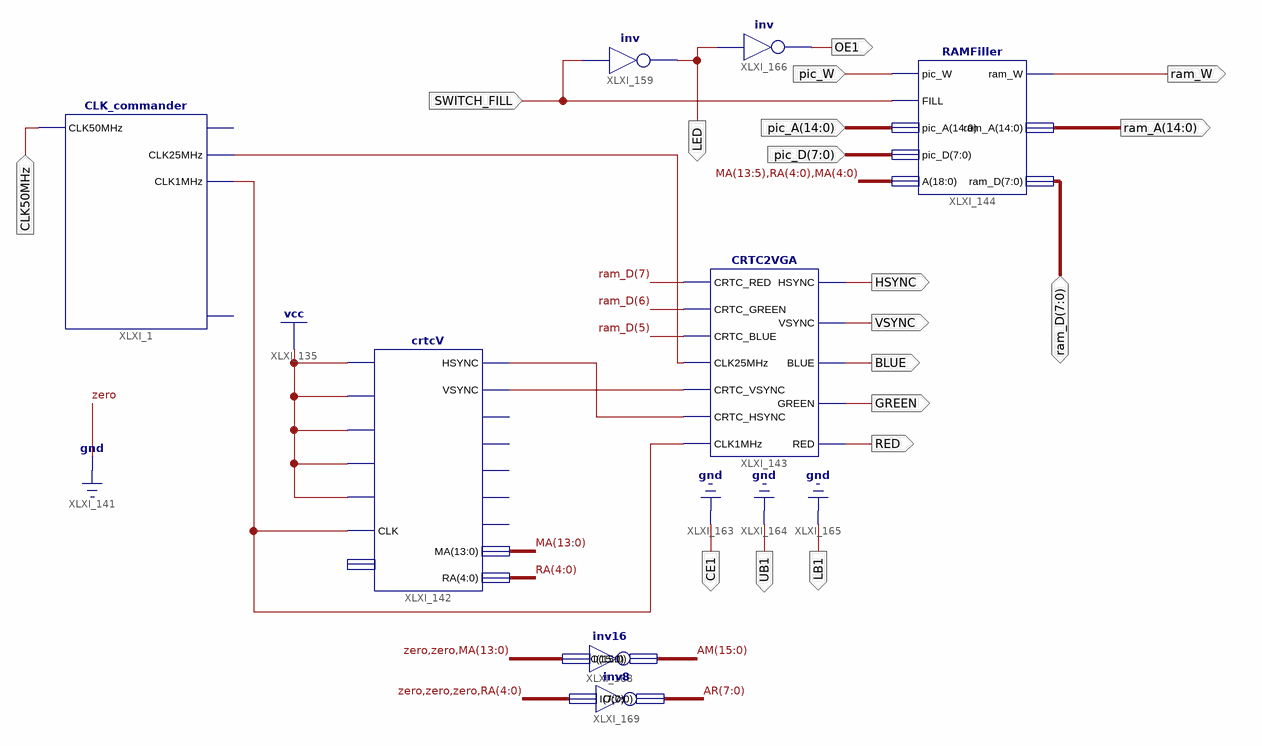
[diagram p0: schematic sheet 1]
// Xilinx ISE schematic externalRAM_test.sch (spartan3) as structural Verilog: 8 symbols, 18 ports
module externalRAM_test (
  input  pic_W,
  input  [14:0] pic_A,
  input  [7:0] pic_D,
  input  SWITCH_FILL,
  input  CLK50MHz,
  inout  [7:0] ram_D,
  output RED,
  output GREEN,
  output BLUE,
  output VSYNC,
  output HSYNC,
  output CE1,
  output UB1,
  output LB1,
  output OE1,
  output LED,
  output ram_W,
  output [14:0] ram_A
);

  wire XLXN_241, XLXN_533, XLXN_534, XLXN_543;
  wire [4:0] RA;
  wire [7:0] AR;
  wire [13:0] MA;
  wire [15:0] AM;

  crtcV XLXI_142 (
    .IOCLK(1'b1), .RS(1'b1), .CS(1'b1), .RW(1'b1), .RESET(1'b1), .CLK(XLXN_543), .HSYNC(XLXN_533),
    .VSYNC(XLXN_534), .MA(MA), .RA(RA));  // open: Din, DISP, CPCHSYNC, CPCVSYNC, CPCDISP, CPCBLACK
  CRTC2VGA XLXI_143 (
    .CRTC_RED(ram_D[7]), .CRTC_GREEN(ram_D[6]), .CRTC_BLUE(ram_D[5]), .CLK25MHz(XLXN_241),
    .CRTC_VSYNC(XLXN_534), .CRTC_HSYNC(XLXN_533), .CLK1MHz(XLXN_543), .HSYNC(HSYNC), .VSYNC(VSYNC),
    .BLUE(BLUE), .GREEN(GREEN), .RED(RED));
  RAMFiller XLXI_144 (
    .pic_W(pic_W), .FILL(SWITCH_FILL), .pic_A(pic_A), .pic_D(pic_D), .A({MA[13:5], RA, MA[4:0]}),
    .ram_W(ram_W), .ram_A(ram_A), .ram_D(ram_D));
  CLK_commander XLXI_1 (.CLK50MHz(CLK50MHz), .CLK25MHz(XLXN_241), .CLK1MHz(XLXN_543));  // open: CLK100MHz, CLK4MHz
  not XLXI_159 (LED, SWITCH_FILL);
  not XLXI_166 (OE1, LED);
  inv16 XLXI_168 (.I({2'b00, MA}), .O(AM));
  inv8 XLXI_169 (.I({3'b000, RA}), .O(AR));

  assign CE1 = 1'b0;
  assign LB1 = 1'b0;
  assign UB1 = 1'b0;
endmodule
